# EAGLE design tweeq-FB_Breadboard v4 (EAGLE 7.2.0)
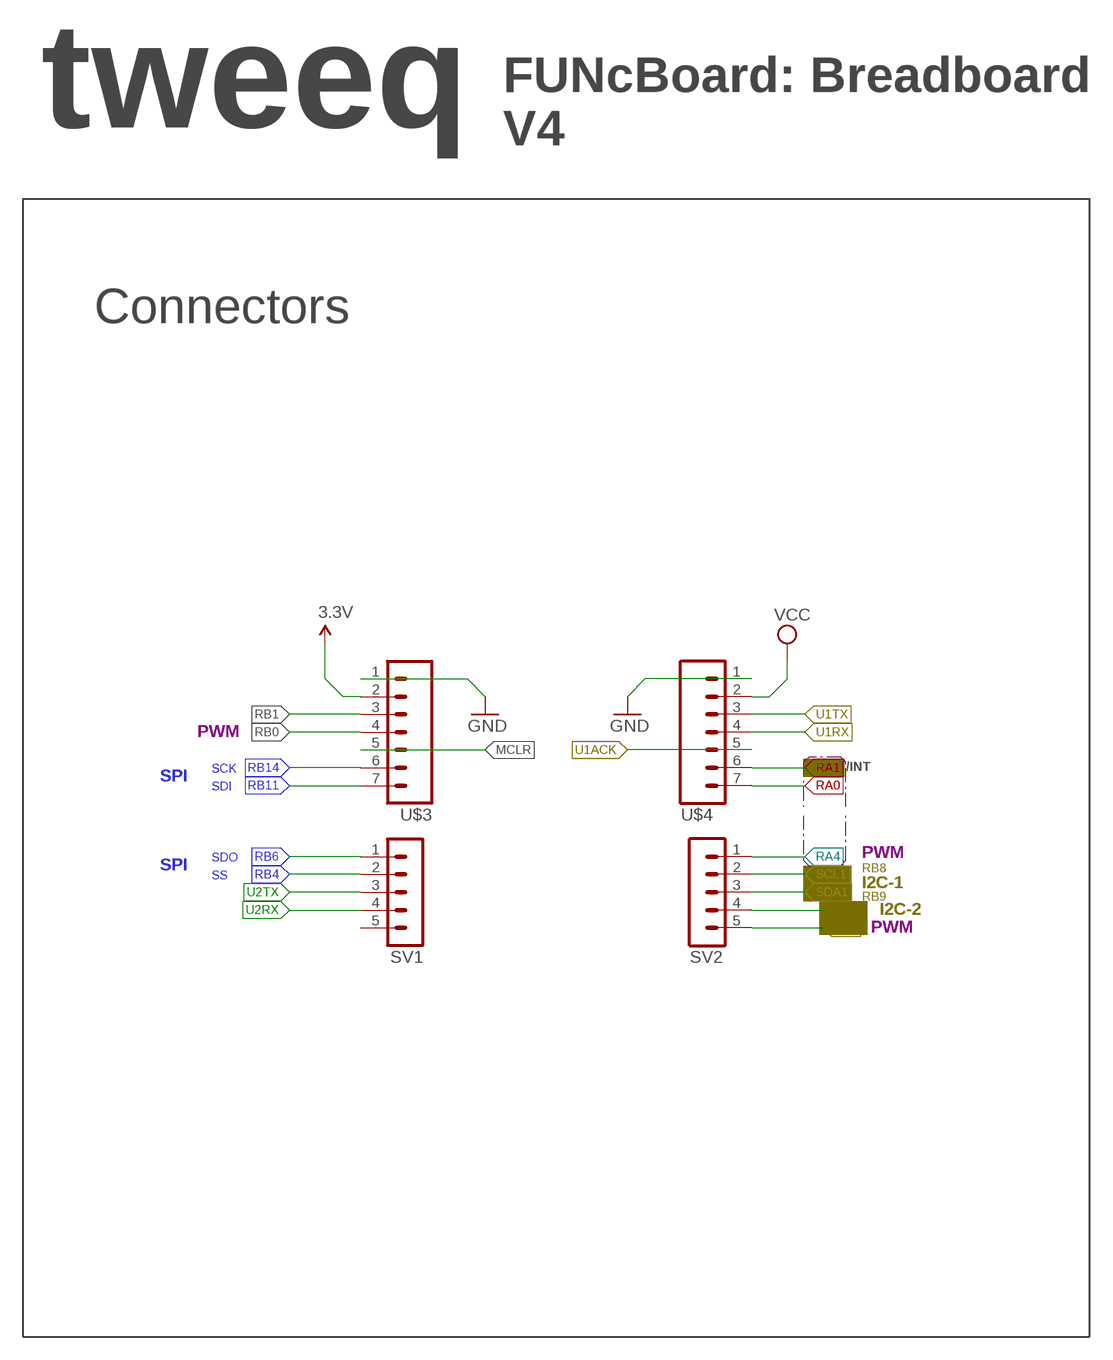
[diagram p0: schematic, sheet 1, part 1 of 2]
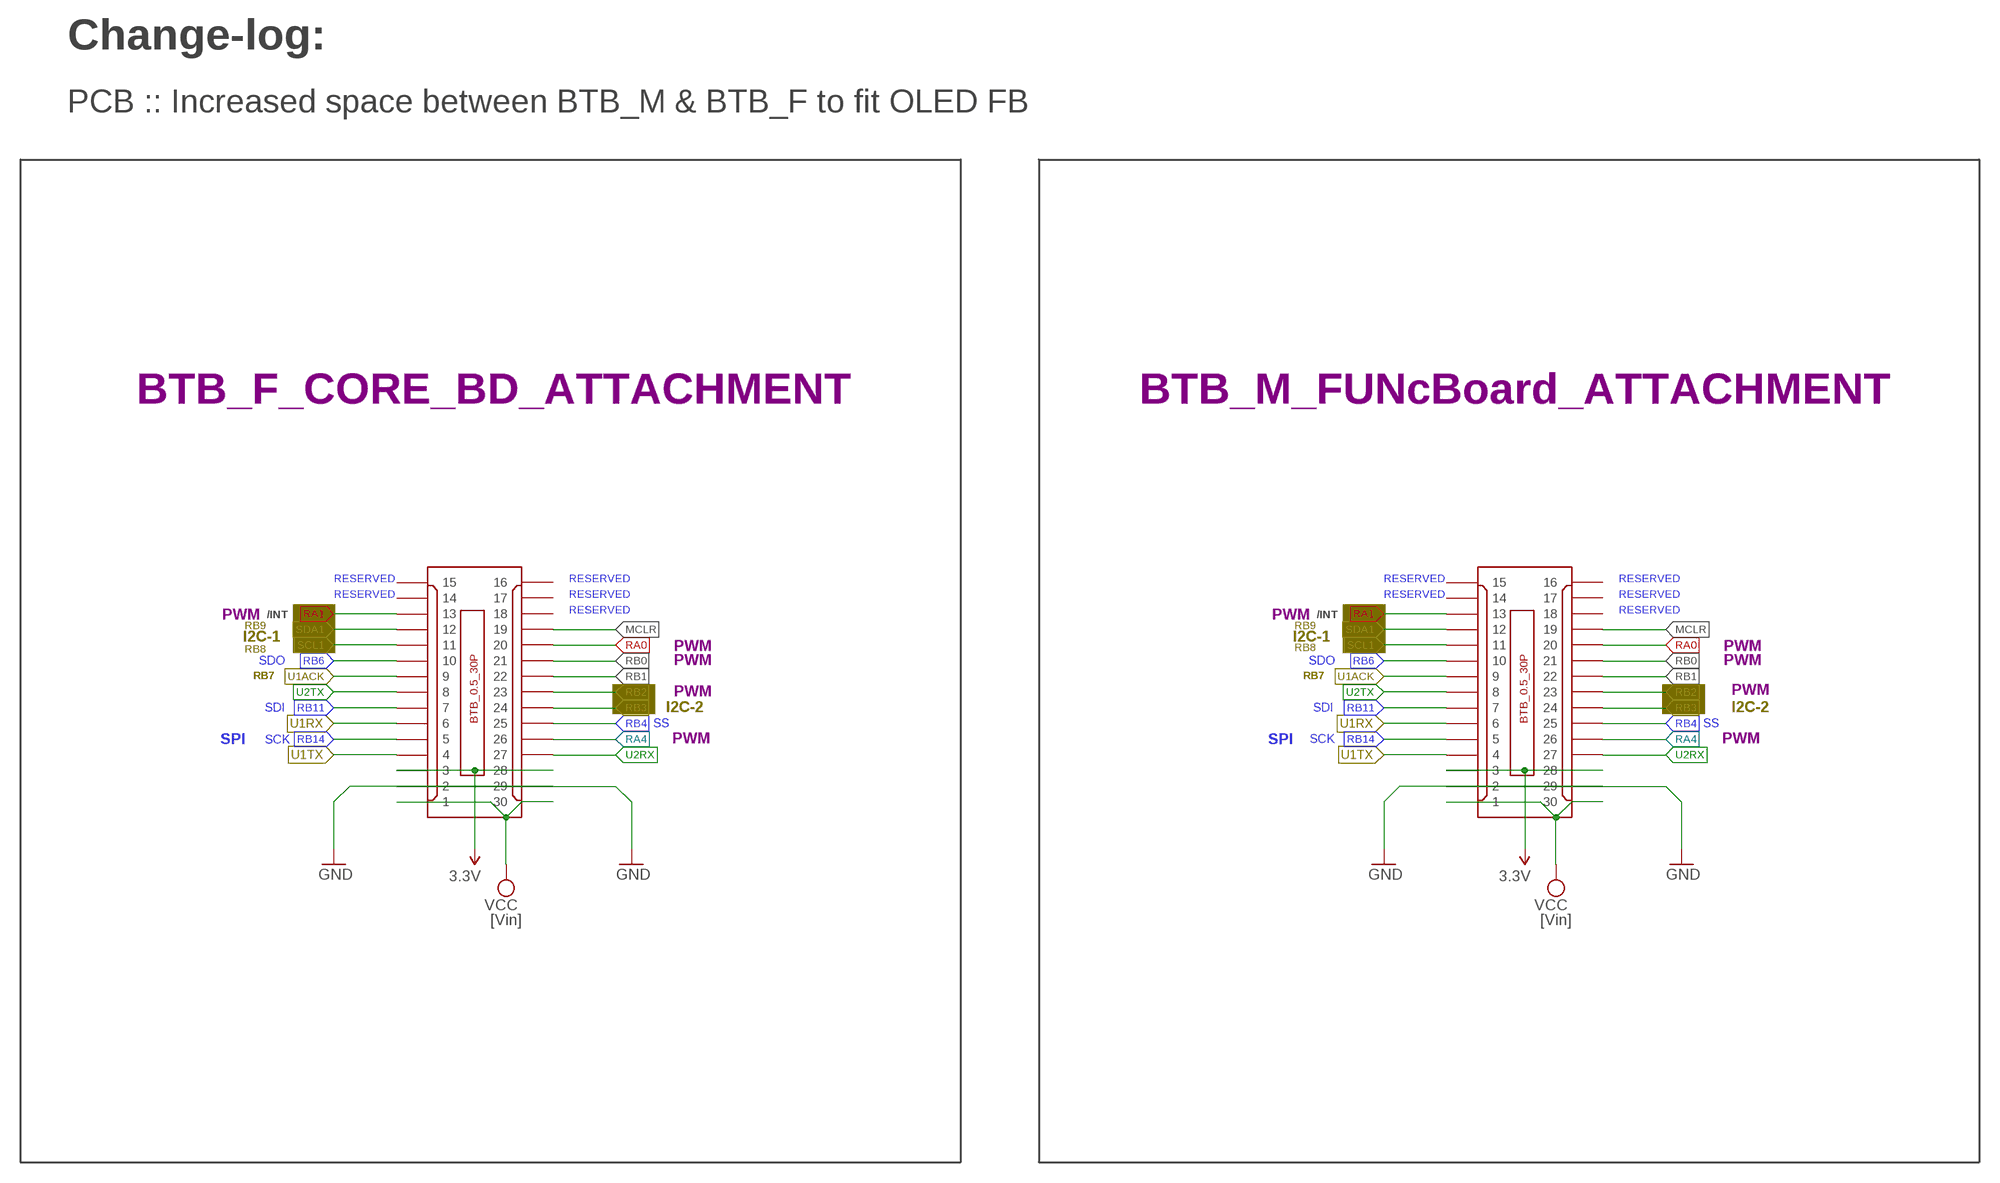
[diagram p1: schematic, sheet 1, part 2 of 2]

## Parts
SV1  M05-1NOSILK  [1X05_NOSILK]
SV2  M05-1NOSILK  [1X05_NOSILK]
U$1  BTB_CONN_30P/M  [BTB0.5-30M-3.0G]
U$2  BTB_CONN_30P/F  [BTB0.5-30F-3.0G]
U$3  M07NOSILK  [1X07_NOSILK]
U$4  M07NOSILK  [1X07_NOSILK]

## Nets
3.3V: U$1.3 U$1.28 U$2.3 U$2.28 U$3.2
GND: U$1.2 U$1.29 U$2.2 U$2.29 U$3.1 U$4.1
MCLR: U$1.19 U$2.19 U$3.5
RA0: U$1.20 U$2.20 U$4.7
RA1: U$1.13 U$2.13 U$4.6
RA4: SV2.1 U$1.26 U$2.26
RB0: U$1.21 U$2.21 U$3.4
RB1: U$1.22 U$2.22 U$3.3
RB2: SV2.5 U$1.23 U$2.23
RB3: SV2.4 U$1.24 U$2.24
RB4: SV1.2 U$1.25 U$2.25
RB6: SV1.1 U$1.10 U$2.10
RB11: U$1.7 U$2.7 U$3.7
RB14: U$1.5 U$2.5 U$3.6
SCL1: SV2.2 U$1.11 U$2.11
SDA1: SV2.3 U$1.12 U$2.12
U1ACK: U$1.9 U$2.9 U$4.5
U1RX: U$1.6 U$2.6 U$4.4
U1TX: U$1.4 U$2.4 U$4.3
U2RX: SV1.4 U$1.27 U$2.27
U2TX: SV1.3 U$1.8 U$2.8
VCC: U$1.1 U$1.30 U$2.1 U$2.30 U$4.2
Unconnected: SV1.5 U$1.14 U$1.15 U$1.16 U$1.17 U$1.18 U$2.14 U$2.15 U$2.16 U$2.17 U$2.18

## Notes on the sheet
- Change-log:
- FUNcBoard: Breadboard
- tweeq
- V4 | PCB :: Increased space between BTB_M & BTB_F to fit OLED FB
- Connectors
- BTB_F_CORE_BD_ATTACHMENT | BTB_M_FUNcBoard_ATTACHMENT
- RESERVED | RESERVED | RESERVED | RESERVED
- RESERVED | RESERVED | RESERVED | RESERVED
- PWM | /INT | PWM | /INT
- RESERVED | RESERVED
- RB9 | RB9
- PWM
- I2C-1 | I2C-1
- RB8 | PWM | RB8 | PWM
- SDO | SDO
- SCK | /INT | PWM | PWM
- SPI | RB7 | RB7
- SDI
- PWM | PWM
- SDI | SDI
- I2C-2 | I2C-2
- SS | SS
- SPI | SCK
- SDO | PWM | SPI | SCK | PWM | PWM
- SPI | RB8
- SS
- I2C-1
- I2C-1 | I2C-1
- RB9
- I2C-2
- PWM
- I2C-2 | I2C-2
- [Vin] | [Vin]

## Library data of the parts
SV1 SV2 = AISCube:M05-1: PIN HEADER Standard 0.1" header pin 5 pins - 1 way
U$1 U$2 = AISCube:BTB_CONN_30P: Board to Board Connector SMD 0.5mm Pitch 30 way - Dual Side (2x15) Total Mating height: 3.0mm
U$3 U$4 = AISCube:M07

## Board
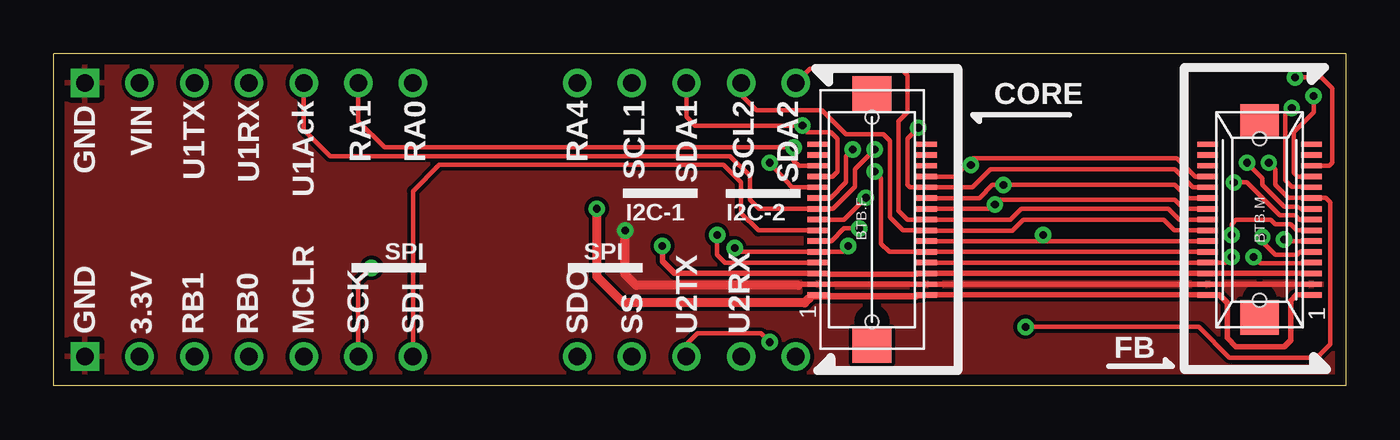
[diagram p2: board, top side]
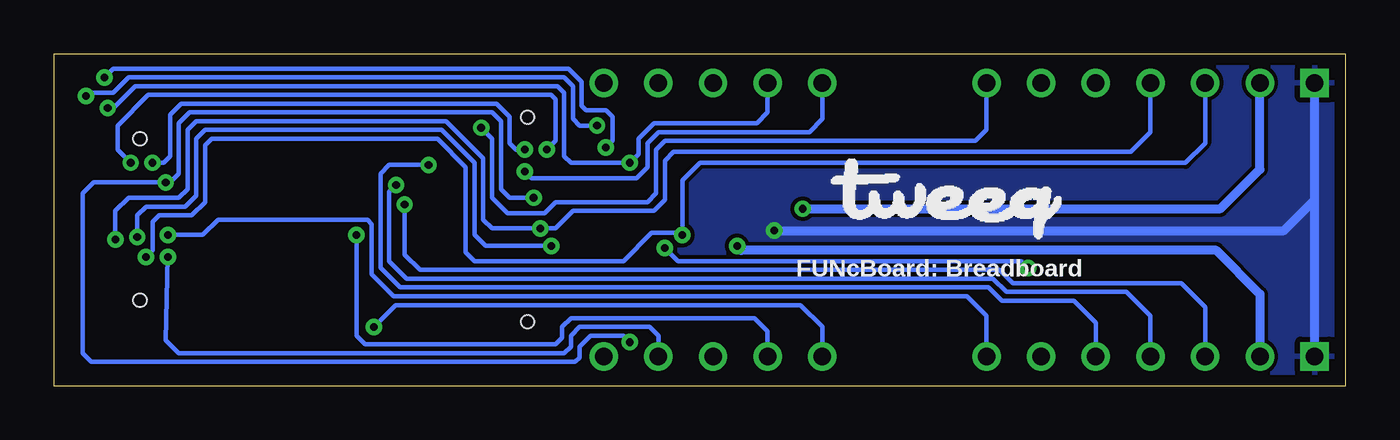
[diagram p3: board, bottom side, seen from below]

Size 60 x 15.42 mm. Coordinates in mm from the lower left corner, seen from the top.
Outline: 0,0 0,15.42 60,15.42 60,0 0,0
Copper layers (1*16): Top 0.0356mm / dielectric 1.5011mm / Bottom 0.0356mm
Design rules "AISCube": minimum track width 7mil, minimum drill 14mil, track to track 7mil, track to pad 7mil, pad to pad 7mil, via to via 7mil, smd to smd 0mil, copper to edge 20mil, drill to drill 8mil, minimum pad ring 10mil, minimum via ring 8mil, stop-mask expansion 4mil, vias tented up to drill 32mil, thermal gap 10mil

### Footprints (pad centres in the part's own frame; a part is rotated, then mirrored left to right if it is on the bottom)
1X05_NOSILK = drill 0.813: 1 0,0; 2 2.54,0; 3 5.08,0; 4 7.62,0; 5 10.16,0
BTB0.5-30M-3.0G = smd 0.25 x 0.95: 1 -3.495,-2.41; 2 -2.995,-2.41; 3 -2.495,-2.41; 4 -1.995,-2.41; 5 -1.495,-2.41; 6 -0.995,-2.41; 7 -0.495,-2.41; 8 0.005,-2.41; 9 0.505,-2.41; 10 1.005,-2.41; 11 1.505,-2.41; 12 2.005,-2.41; 13 2.505,-2.41; 14 3.005,-2.41; 15 3.505,-2.41; 16 3.505,2.41; 17 3.005,2.41; 18 2.505,2.41; 19 2.005,2.41; 20 1.505,2.41; 21 1.005,2.41; 22 0.505,2.41; 23 0.005,2.41; 24 -0.495,2.41; 25 -0.995,2.41; 26 -1.495,2.41; 27 -1.995,2.41; 28 -2.495,2.41; 29 -2.995,2.41; 30 -3.495,2.41 | smd 1.6 x 1.8: P$1 -4.545,0; P$2 4.555,0 | hole 0.6: -3.745,0; 3.755,0
BTB0.5-30F-3.0G = smd 0.25 x 1: 1 -3.495,2.49; 2 -2.995,2.49; 3 -2.495,2.49; 4 -1.995,2.49; 5 -1.495,2.49; 6 -0.995,2.49; 7 -0.495,2.49; 8 0.005,2.49; 9 0.505,2.49; 10 1.005,2.49; 11 1.505,2.49; 12 2.005,2.49; 13 2.505,2.49; 14 3.005,2.49; 15 3.505,2.49; 16 3.505,-2.51; 17 3.005,-2.51; 18 2.505,-2.51; 19 2.005,-2.51; 20 1.505,-2.51; 21 1.005,-2.51; 22 0.505,-2.51; 23 0.005,-2.51; 24 -0.495,-2.51; 25 -0.995,-2.51; 26 -1.495,-2.51; 27 -1.995,-2.51; 28 -2.495,-2.51; 29 -2.995,-2.51; 30 -3.495,-2.51 | smd 1.6 x 1.8: P$1 -5.845,0; P$2 5.855,0 | hole 0.6: -4.745,0; 4.755,0
1X07_NOSILK = drill 0.813 square: 1 0,0 | drill 0.813: 2 2.54,0; 3 5.08,0; 4 7.62,0; 5 10.16,0; 6 12.7,0; 7 15.24,0

### Placement (x,y rotation side)
SV1  24.3,1.37 0 top
SV2  24.3,14.07 0 top
U$1  56,7.72 90 top
U$2  38,7.72 90 top
U$3  1.44,1.37 0 top
U$4  1.44,14.07 0 top
U$5  [TWEEQ-LOGO-L]  23.9,6.81 0 bottom

### Tracks (layer width: path | path; a pad name or v marks a point on that pad's centre or on a via)
3.3V  (via drill 0.36)
  Top 0.203: U$2.3 35.95,5.22 35.99,5.18 | 40.05,5.18 40.47,5.18 U$2.28
  Top 0.254: U$1.3 U$1.28 U$2.28 | U$2.3 28.83,5.22 28.27,5.79 v28.27,6.5 | 35.99,5.18 40.05,5.18
  Bottom 0.406: U$3.2 3.98,4.27 6.02,6.3 28.06,6.3 v28.27,6.5
GND  (via drill 0.36)
  Top 0.254: U$1.2 U$1.29 U$2.29 U$2.2 34.62,4.72 34.57,4.67
  Top 0.406: 34.57,4.67 27.05,4.67 26.54,5.18 v26.54,7.21
  Bottom 0.406: U$3.1 U$4.1 1.44,8.64 2.87,7.21 v26.54,7.21
  pour Top: 0.2,15.24 59.87,15.24 59.87,0.2 0.2,0.2
  pour Bottom: 0.2,15.24 59.87,15.24 59.87,0.2 0.2,0.2
MCLR  (via drill 0.36)
  Top 0.203: U$2.19 41.85,9.72 42.39,10.26 | U$1.19 53.01,9.72 52.16,10.57 42.69,10.57 42.39,10.26 | 42.39,10.26 v42.59,10.26
  Bottom 0.203: U$3.5 11.6,2.95 12.62,3.96 15.97,3.96 16.58,4.57 43.91,4.57 44.83,5.49 44.83,9.86 44.42,10.26 v42.59,10.26
RA0  (via drill 0.36)
  Top 0.203: U$1.20 52.9,9.22 52.06,10.06 43.51,10.06 42.67,9.22 U$2.20 39.77,9.22 39.65,9.35 39.65,11.48 v40.15,11.99
  Bottom 0.203: U$4.7 16.68,11.89 17.19,11.38 31.62,11.38 32.03,10.97 32.03,8.94 32.43,8.53 36.7,8.53 37.21,8.03 38.93,8.03 39.65,8.74 39.65,11.48 v40.15,11.99
RA1  (via drill 0.36)
  Top 0.203: U$2.13 34.6,10.22 34.36,10.46 v34.36,11.07 15.36,11.07 14.14,12.29 U$4.6 | U$1.13 59.24,10.22 59.38,10.36 59.38,13.82 58.87,14.33 v57.65,14.33
  Bottom 0.203: v57.65,14.33 57.24,14.73 36.09,14.73 35.48,14.12 35.48,13.01 35.28,12.8 34.36,12.8 34.06,12.5 34.06,11.38 v34.36,11.07
RA4  (via drill 0.36)
  Top 0.203: U$1.26 U$2.26 38.8,6.22 38.43,6.6 38.43,9.65 v38.12,9.96
  Bottom 0.203: SV2.1 24.3,12.39 24.91,11.79 31.92,11.79 32.43,11.28 32.43,10.16 32.94,9.65 37.82,9.65 v38.12,9.96
RB0  (via drill 0.36)
  Top 0.203: U$1.21 52.69,8.72 52.08,9.34 v44.1,9.34 43.59,9.34 42.99,8.72 U$2.21
  Bottom 0.203: U$3.4 9.06,3.25 10.18,4.37 15.77,4.37 16.38,4.98 43.61,4.98 44.42,5.79 44.42,9.02 v44.1,9.34
RB1  (via drill 0.36)
  Top 0.203: U$1.22 52.47,8.22 52.06,8.64 43.91,8.64 v43.71,8.43 43.5,8.22 U$2.22
  Bottom 0.203: U$3.3 6.52,3.66 7.64,4.78 15.46,4.78 16.07,5.38 43,5.38 43.71,6.1 v43.71,8.43
RB2
  Top 0.203: SV2.5 35.13,14.73 39.34,14.73 39.65,14.43 39.65,12.7 39.24,12.29 39.24,8.13 39.64,7.72 U$2.23 44.42,7.72 44.93,8.23 51.76,8.23 52.27,7.72 53.61,7.72 U$1.23
RB3
  Top 0.203: U$1.24 52.05,7.22 51.55,7.72 45.03,7.72 44.52,7.21 40.52,7.21 U$2.24 39.43,7.22 38.83,7.82 38.83,11.38 38.53,11.68 36.8,11.68 35.68,12.8 32.64,12.8 31.92,13.51 SV2.4
RB4  (via drill 0.36)
  Top 0.203: U$2.25 45.23,6.72 45.66,6.72 | 45.66,6.72 v45.95,7.01 | U$1.25 45.66,6.72
  Bottom 0.203: v45.95,7.01 45.95,2.34 45.54,1.93 36.7,1.93 36.39,2.23 36.39,2.74 35.99,3.15 27.45,3.15 26.84,2.54 SV1.2
RB6  (via drill 0.36)
  Top 0.203: v56.43,10.36 56.74,10.06 56.74,9.35 57.35,8.74 58.4,8.74 U$1.10 58.42,8.74 59.07,8.74 59.28,8.53 59.28,1.93 58.67,1.32 54.6,1.32 53.18,2.74 v45.13,2.74 | U$2.10 36.08,8.72 36.8,9.45 36.8,10.67 v37.11,10.97
  Bottom 0.203: 56.63,10.57 v56.43,10.36 57.04,10.97 57.04,12.09 55.62,13.51 36.9,13.51 36.7,13.31 36.7,11.38 v37.11,10.97 | SV1.1 24.3,2.74 25.32,3.76 44.12,3.76 v45.13,2.74
RB11  (via drill 0.36)
  Top 0.203: U$1.7 57.74,7.22 57.45,7.52 56.74,7.52 56.53,7.72 54.91,7.72 54.7,7.52 v54.7,7.01 | U$2.7 32.73,7.22 31.92,8.03 31.92,9.45 31.11,10.26 17.9,10.26 16.68,9.04 U$3.7
  Bottom 0.203: U$3.7 16.68,3.25 17.6,4.17 44.22,4.17 45.23,5.18 45.23,7.52 45.44,7.72 52.37,7.72 53.08,7.01 v54.7,7.01
RB14  (via drill 0.36)
  Top 0.203: U$3.6 14.14,4.88 v14.75,5.49 | v31.62,6.4 31.8,6.22 U$2.5 36.67,6.22 v36.9,6.5 | U$1.5 57.88,6.22 57.75,6.1 56.74,6.1 56.13,6.71 v56.13,6.91
  Bottom 0.203: v56.13,6.91 56.13,7.92 55.72,8.33 53.89,8.33 53.38,8.84 53.38,11.48 52.98,11.89 41.98,11.89 40.46,10.36 40.46,7.01 39.95,6.5 v36.9,6.5 | v14.75,5.49 15.06,5.79 31.01,5.79 v31.62,6.4
SCL1  (via drill 0.36)
  Top 0.203: U$1.11 58.39,9.25 57.5,9.25 57.19,9.55 57.19,12.6 v57.5,12.9 | U$2.11 34.28,9.22 v33.25,10.36
  Bottom 0.203: v57.5,12.9 57.24,12.9 56.23,13.92 36.6,13.92 36.29,13.61 36.29,10.67 35.99,10.36 v33.25,10.36 32.84,10.77 32.84,11.48 32.13,12.19 27.35,12.19 26.84,12.7 SV2.2
SDA1  (via drill 0.36)
  Top 0.203: U$1.12 57.78,9.72 57.6,9.91 57.6,11.79 58.51,12.7 v58.51,13.46 | U$2.12 36.16,9.72 36.39,9.96 36.39,11.48 36.09,11.79 34.97,11.79 v34.77,12.09 29.79,12.09 29.38,12.5 SV2.3
  Bottom 0.203: v58.51,13.46 58.36,13.61 57.24,13.61 56.53,14.33 36.29,14.33 35.89,13.92 35.89,12.39 35.58,12.09 v34.77,12.09
U1ACK  (via drill 0.36)
  Top 0.203: U$1.9 57.91,8.22 57.75,8.33 57.14,8.33 56.13,9.35 56.13,9.65 v55.41,10.36 | U$4.5 11.6,11.89 12.82,10.67 31.42,10.67 32.33,9.75 32.33,8.64 32.74,8.22 U$2.9 36.19,8.22 37.21,9.25 37.21,10.06 v38.12,10.97
  Bottom 0.203: v55.41,10.36 54.91,10.36 54.6,10.67 54.6,12.6 54.09,13.11 39.44,13.11 38.83,12.5 38.83,11.28 38.53,10.97 v38.12,10.97
U1RX  (via drill 0.36)
  Top 0.203: U$1.6 57.23,6.72 v57.14,6.81 | U$2.6 36.11,6.72 36.7,7.32 v37.41,7.32
  Bottom 0.203: v57.14,6.81 57.14,8.13 56.53,8.74 54.2,8.74 53.79,9.14 53.79,11.89 53.38,12.29 41.78,12.29 40.05,10.57 40.05,7.72 39.65,7.32 v37.41,7.32 36.7,7.32 35.89,8.13 32.13,8.13 31.62,8.64 31.62,10.46 31.21,10.87 9.98,10.87 9.06,11.79 U$4.4
U1TX  (via drill 0.36)
  Top 0.203: U$2.4 31.18,5.72 30.81,6.1 v30.81,7.01 | U$1.4 58.38,5.69 56.02,5.69 v55.72,5.99
  Bottom 0.203: U$4.3 6.52,11.28 7.44,10.36 29.99,10.36 30.81,9.55 v30.81,7.01 30.91,7.11 32.23,7.11 33.55,5.79 40.46,5.79 40.87,6.2 40.87,10.16 42.19,11.48 52.67,11.48 52.98,11.18 52.98,8.53 53.59,7.92 55.11,7.92 55.41,7.62 55.41,6.3 v55.72,5.99
U2RX  (via drill 0.36)
  Top 0.203: U$2.27 U$1.27 54.44,5.72 v54.7,5.99
  Bottom 0.203: 31.92,1.73 SV1.4 31.92,2.34 32.33,2.74 35.58,2.74 35.99,2.34 35.99,1.83 36.29,1.52 54.2,1.52 54.81,2.13 v54.7,5.99
U2TX  (via drill 0.36)
  Top 0.203: SV1.3 29.38,1.93 29.89,2.44 32.84,2.44 v33.25,2.03 | U$1.8 57.85,7.72 57.65,7.92 56.94,7.92 55.41,9.45 v54.81,9.45 | U$2.8 36.7,7.72 v37.72,8.74
  Bottom 0.203: v33.25,2.03 33.55,2.34 35.07,2.34 35.58,1.83 35.58,1.32 35.78,1.12 58.26,1.12 58.67,1.52 58.67,8.94 58.16,9.45 v54.81,9.45 54.6,9.45 54.2,9.86 54.2,12.19 53.69,12.7 39.65,12.7 39.24,12.29 39.24,9.14 38.83,8.74 v37.72,8.74
VCC  (via drill 0.36)
  Top 0.203: U$2.1 35.34,4.22 35.28,4.17 | 40.05,4.17 40.45,4.17 U$2.30
  Top 0.254: U$2.30 U$1.30 54.14,4.22 54.5,3.86 54.5,2.23 54.91,1.83 57.14,1.83 57.45,2.13 57.45,3.96 57.71,4.22 U$1.1 | U$2.1 35.23,4.22 35.07,4.06
  Top 0.305: 35.28,4.17 40.05,4.17
  Top 0.406: 35.07,4.06 34.87,3.86 26.44,3.86 25.22,5.08 v25.22,8.23
  Bottom 0.406: U$4.2 3.98,10.06 5.81,8.23 v25.22,8.23

### Text on the board
tPlace: GND | VIN | U1TX | U1RX | U1Ack | RA1 | RA0 | RA4 | SCL1 | SDA1 | SCL2 | SDA2 | CORE | I2C-1 | I2C-2 | SPI | SPI | GND | 3.3V | RB1 | RB0 | MCLR | SCK | SDI | SDO | SS | U2TX | U2RX | FB
bPlace: FUNcBoard: Breadboard